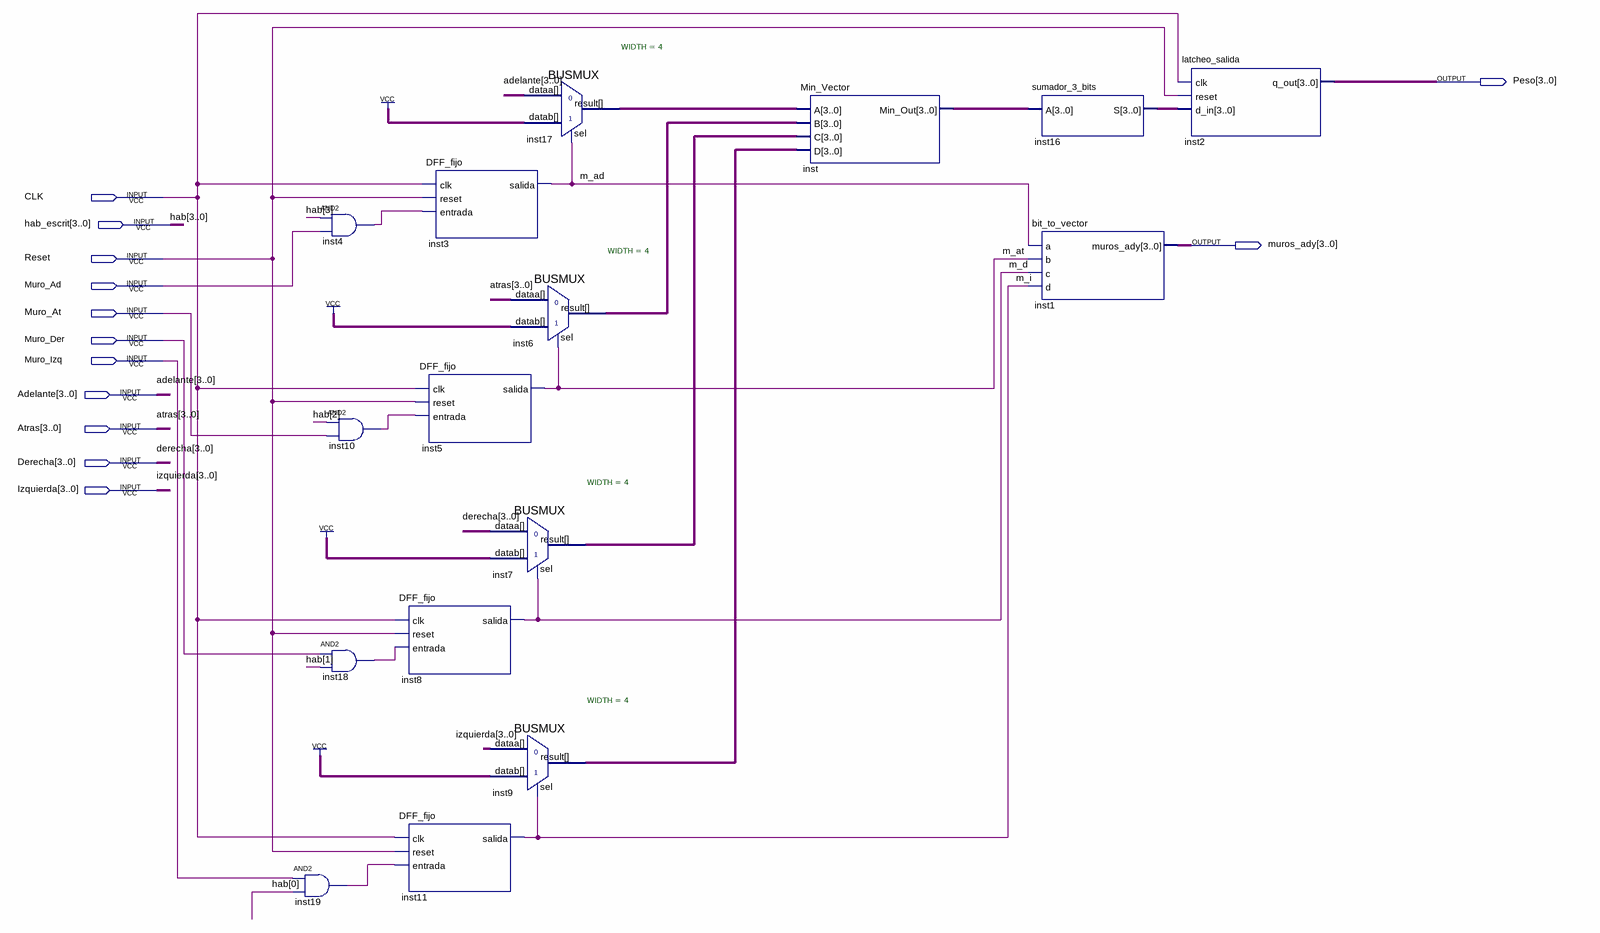
[diagram p0: schematic sheet]
// Quartus schematic Celda.bdf as structural Verilog: 16 symbols, 13 pins
module Celda (
  input  CLK,
  input  [3:0] hab_escrit,
  input  Reset,
  input  Muro_Ad,
  input  Muro_At,
  input  Muro_Der,
  input  Muro_Izq,
  input  [3:0] Adelante,
  input  [3:0] Atras,
  input  [3:0] Derecha,
  input  [3:0] Izquierda,
  output [3:0] Peso,
  output [3:0] muros_ady
);

  wire inst4_out, inst10_out, inst18_out, inst19_out, m_ad, m_at, m_d, m_i;
  wire [3:0] inst6_result, inst7_result, inst9_result, inst16_s, inst17_result, inst_min_out;

  and inst4 (inst4_out, hab_escrit[3], Muro_Ad);
  and inst10 (inst10_out, hab_escrit[2], Muro_At);
  and inst18 (inst18_out, Muro_Der, hab_escrit[1]);
  and inst19 (inst19_out, Muro_Izq, hab_escrit[0]);
  DFF_fijo inst8 (.clk(CLK), .reset(Reset), .entrada(inst18_out), .salida(m_d));
  DFF_fijo inst11 (.clk(CLK), .reset(Reset), .entrada(inst19_out), .salida(m_i));
  DFF_fijo inst3 (.clk(CLK), .reset(Reset), .entrada(inst4_out), .salida(m_ad));
  DFF_fijo inst5 (.clk(CLK), .reset(Reset), .entrada(inst10_out), .salida(m_at));
  BUSMUX #(.WIDTH(4)) inst7 (.datab(4'b1111), .sel(m_d), .dataa(Derecha), .result(inst7_result));
  BUSMUX #(.WIDTH(4)) inst9 (.datab(4'b1111), .sel(m_i), .dataa(Izquierda), .result(inst9_result));
  BUSMUX #(.WIDTH(4)) inst17 (.datab(4'b1111), .sel(m_ad), .dataa(Adelante), .result(inst17_result));
  BUSMUX #(.WIDTH(4)) inst6 (.datab(4'b1111), .sel(m_at), .dataa(Atras), .result(inst6_result));
  Min_Vector inst (.A(inst17_result), .B(inst6_result), .C(inst7_result), .D(inst9_result), .Min_Out(inst_min_out));
  sumador_3_bits inst16 (.A(inst_min_out), .S(inst16_s));
  bit_to_vector inst1 (.a(m_ad), .b(m_at), .c(m_d), .d(m_i), .muros_ady(muros_ady));
  latcheo_salida inst2 (.clk(CLK), .reset(Reset), .d_in(inst16_s), .q_out(Peso));

  // Other names for the same wires on the sheet: hab[3:0] = hab_escrit
endmodule
